# EAGLE design avr_adapter (EAGLE 9.6.2)
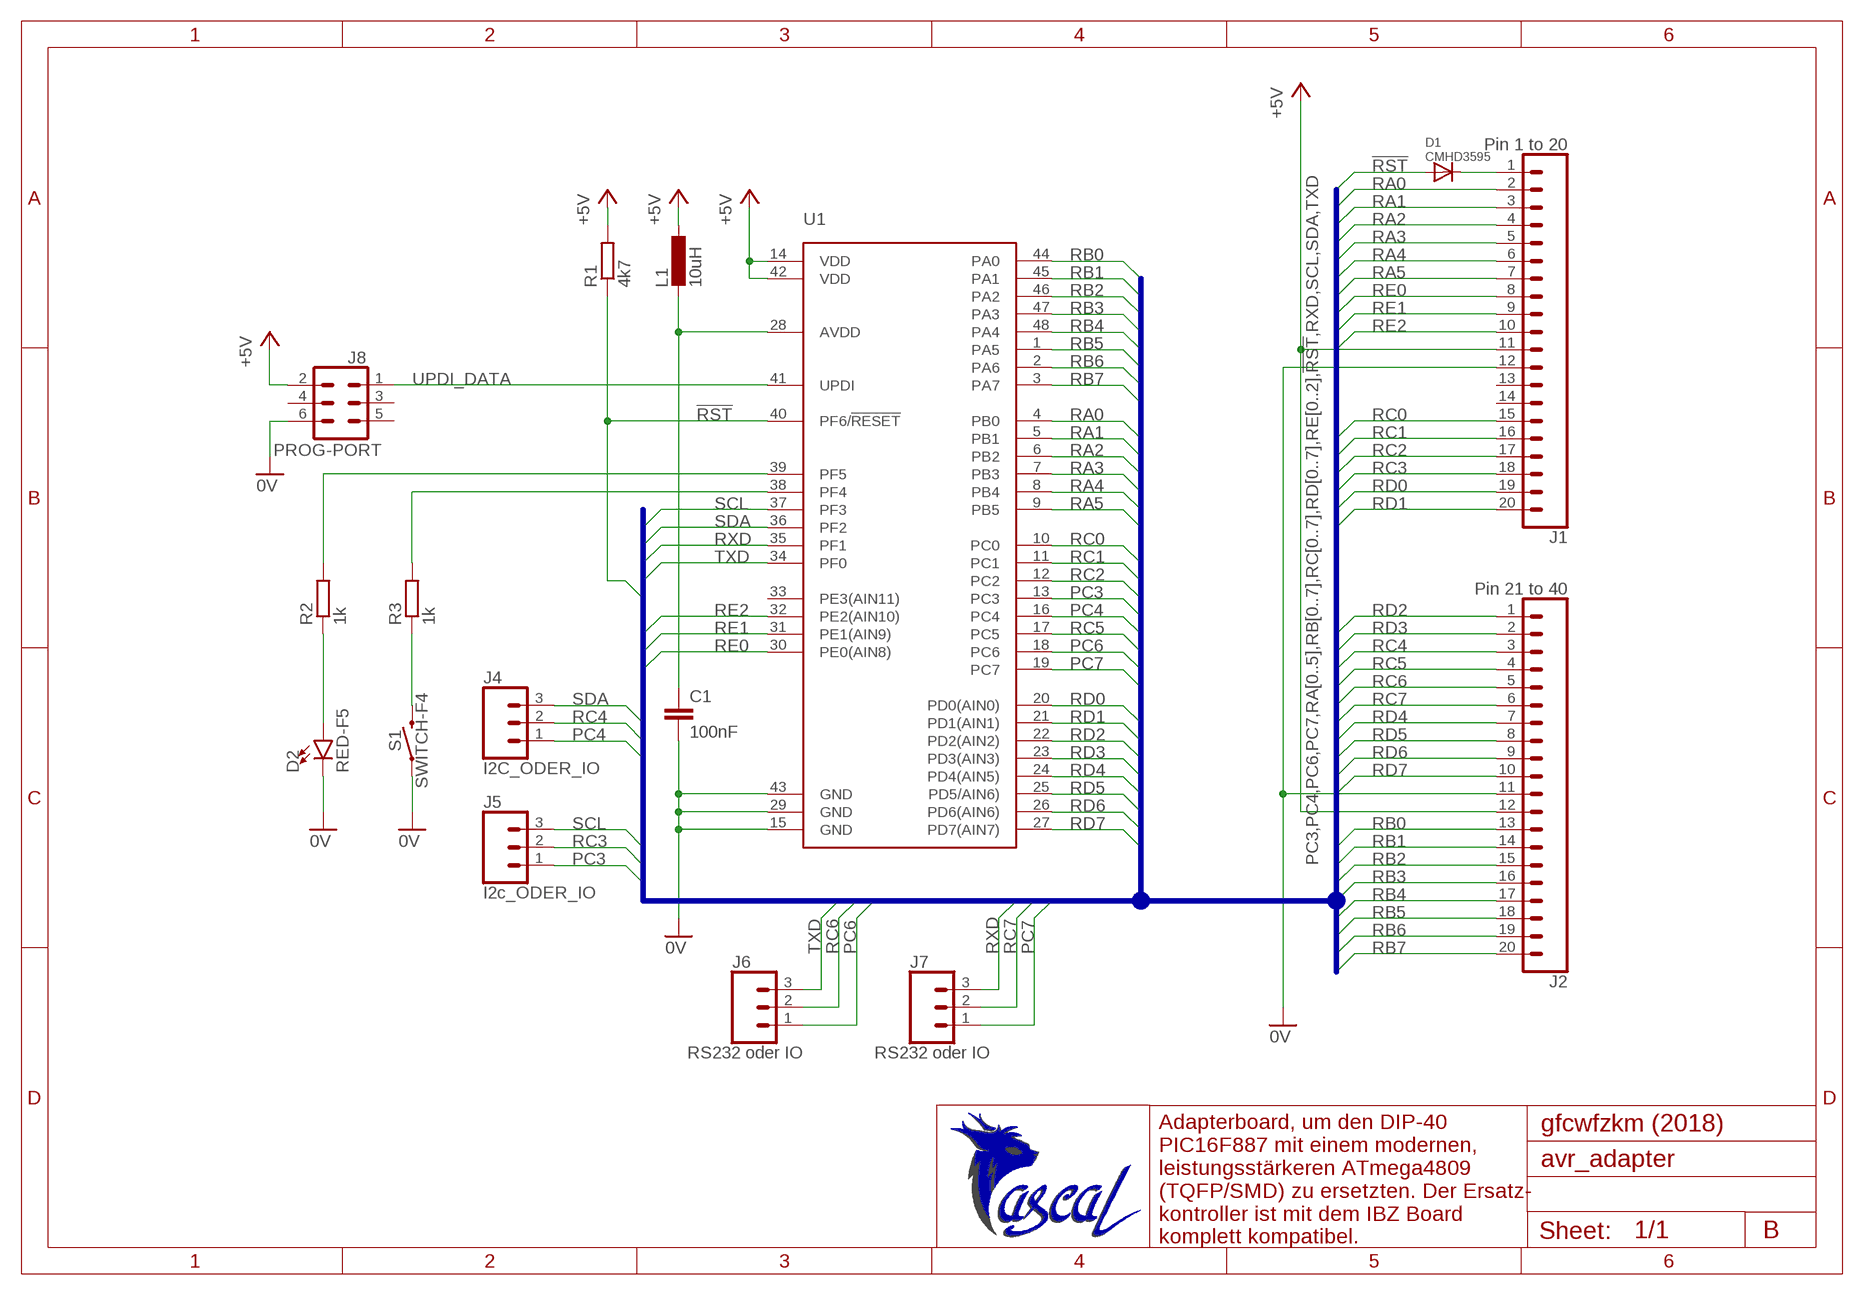
[diagram p0: schematic, sheet 1]

## Parts
C1  100nF  C-EUC0805  [C0805]
D1  CMHD3595  DIODESOD-123  [SOD-123]
D2  RED-F5  LED-FKIT-1206  [FKIT-LED-1206]
J1  Pin 1 to 20  CONN_20  [1X20]
J2  Pin 21 to 40  CONN_20  [1X20]
J4  I2C_ODER_IO  CONN_03  [1X03]
J5  I2c_ODER_IO  CONN_03  [1X03]
J6  RS232 oder IO  CONN_03  [1X03]
J7  RS232 oder IO  CONN_03  [1X03]
J8  PROG-PORT  CONN_03X2FEMALE  [2X3]
L1  10uH  L-EUL2012C  [L2012C]
R1  4k7  R-EU_R0805  [R0805]
R2  1k  R-EU_R0805  [R0805]
R3  1k  R-EU_R0805  [R0805]
S1  SWITCH-F4  MOMENTARY-SWITCH-SPST-SMD-6.0X3.5MM  [TACTILE_SWITCH_SMD_6.0X3.5MM]
U1  ATMEGA4809ATMEGA4809_TQFP48  [TQFP-48]
U$1  LOGO_PASCAL_GESELLEMPTY  [EMPTY]

## Nets
0V: C1.2 D2.C J1.12 J2.11 J8.6 S1.1 U1.15(GND) U1.29(GND) U1.43(GND)
!RST: D1.A R1.1 U1.40(PF6/!RESET)
+5V: J1.11 J2.12 J8.2 L1.1 R1.2 U1.14(VDD) U1.42(VDD)
N$1: D1.C J1.1
N$2: R2.2 U1.39(PF5)
N$3: C1.1 L1.2 U1.28(AVDD)
N$4: R3.2 U1.38(PF4)
N$5: D2.A R2.1
N$6: R3.1 S1.2
PC3: J5.1 U1.13(PC3)
PC4: J4.1 U1.16(PC4)
PC6: J6.1 U1.18(PC6)
PC7: J7.1 U1.19(PC7)
RA0: J1.2 U1.4(PB0)
RA1: J1.3 U1.5(PB1)
RA2: J1.4 U1.6(PB2)
RA3: J1.5 U1.7(PB3)
RA4: J1.6 U1.8(PB4)
RA5: J1.7 U1.9(PB5)
RB0: J2.13 U1.44(PA0)
RB1: J2.14 U1.45(PA1)
RB2: J2.15 U1.46(PA2)
RB3: J2.16 U1.47(PA3)
RB4: J2.17 U1.48(PA4)
RB5: J2.18 U1.1(PA5)
RB6: J2.19 U1.2(PA6)
RB7: J2.20 U1.3(PA7)
RC0: J1.15 U1.10(PC0)
RC1: J1.16 U1.11(PC1)
RC2: J1.17 U1.12(PC2)
RC3: J1.18 J5.2
RC4: J2.3 J4.2
RC5: J2.4 U1.17(PC5)
RC6: J2.5 J6.2
RC7: J2.6 J7.2
RD0: J1.19 U1.20(PD0(AIN0))
RD1: J1.20 U1.21(PD1(AIN1))
RD2: J2.1 U1.22(PD2(AIN2))
RD3: J2.2 U1.23(PD3(AIN3))
RD4: J2.7 U1.24(PD4(AIN5))
RD5: J2.8 U1.25(PD5/AIN6))
RD6: J2.9 U1.26(PD6(AIN6))
RD7: J2.10 U1.27(PD7(AIN7))
RE0: J1.8 U1.30(PE0(AIN8))
RE1: J1.9 U1.31(PE1(AIN9))
RE2: J1.10 U1.32(PE2(AIN10))
RXD: J7.3 U1.35(PF1)
SCL: J5.3 U1.37(PF3)
SDA: J4.3 U1.36(PF2)
TXD: J6.3 U1.34(PF0)
UPDI_DATA: J8.1 U1.41(UPDI)
Unconnected: J1.13 J1.14 J8.3 J8.4 J8.5 U1.33(PE3(AIN11))

## Buses
PC3,PC4,PC6,PC7,RA[0..5],RB[0..7],RC[0..7],RD[0..7],RE[0..2],!RST,RXD,SCL,SDA,TXD

## Notes on the sheet
- Adapterboard, um den DIP-40
  PIC16F887 mit einem modernen,
  leistungsstärkeren ATmega4809
  (TQFP/SMD) zu ersetzten. Der Ersatz-
  kontroller ist mit dem IBZ Board
  komplett kompatibel.
- gfcwfzkm (2018)
- B

## Library data of the parts
C1 = rcl:C-EU: CAPACITOR, European symbol; SPICEPREFIX: C
D1 = adafruit:DIODE: Diode SMADIODE - SMA Surface Mount Package 20V 1A Schottky Diode Digikey: 641-1014-6-ND DO-1N4148 - Through Hole Small Current Diode SOD-123 20V 1 A (.5mV Vf) Schottky Diode - Digikey: MBRX120TPMSCT-ND SOD-323 10V 570mA (.38mV Vf, 3ns) Schottky Diode - Digikey: ZLLS410CT-ND SOD-523 30V 30mA Schottky Diode (RB751S-40TE61) - Digikey: RB751S-40TE61CT-ND SOT23-R/W - SOT23 Package (R = Solder Paste/Reflow Ovens, W = Hand-Soldering) BAT54Film 40V 300mA - Digikey: 497-7162-1-ND
D2 = SparkFun-LED:LED: LED (Generic) Standard schematic elements and footprints for 5mm, 3mm, 1206, and 0603 sized LEDs. Generic LEDs with no color specified.
J1 J2 = SparkFun-Connectors:CONN_20: Multi connection point. Often used as Generic Header-pin footprint for 0.1 inch spaced/style header connections On any of the 0.1 inch spaced packages, you can populate with these: Break Away Headers - Straight <https://www.sparkfun.com/products/116> (PRT-00116) Break Away Male Headers - Right Angle <https://www.sparkfun.com/products/553> (PRT-00553) Female Headers <https://www.sparkfun.com/products/115> (PRT-00115) Break Away Headers - Machine Pin <https://www.sparkfun.com/products/117> (PRT-00117) Break Away Female Headers - Swiss Machine Pin <https://www.sparkfun.com/products/743> (PRT-00743) For SCREWTERMINALS and SPRING TERMINALS visit here: Screw Terimnals on SparkFun.com <https://www.sparkfun.com/search/results?term=Screw+Terminals> (5mm/3.5mm/2.54mm spacing) This device is also useful as a general connection point to wire up your design to another part of your project. Our various solder wires solder well into these plated through hole pads. Hook-Up Wire - Assortment (Stranded, 22 AWG) <https://www.sparkfun.com/products/11375> (PRT-11375) Hook-Up Wire - Assortment (Solid Core, 22 AWG) <https://www.sparkfun.com/products/11367> (PRT-11367) View the entire wire category on our website here <https://www.sparkfun.com/categories/141> Special notes: Molex polarized connector foot print use with SKU : PRT-08231 with associated crimp pins and housings. 1MM SMD Version SKU: PRT-10208 NOTES ON THE VARIANTS LOCK and LOCK_LONGPADS... This footprint was designed to help hold the alignment of a through-hole component (i.e. 6-pin header) while soldering it into place. You may notice that each hole has been shifted either up or down by 0.005 of an inch from it's more standard position (which is a perfectly straight line). This slight alteration caused the pins (the squares in the middle) to touch the edges of the holes. Because they are alternating, it causes a "brace" to hold the component in place. 0.005 has proven to be the perfect amount of "off-center" position when using our standard breakaway headers. Although looks a little odd when you look at the bare footprint, once you have a header in there, the alteration is very hard to notice. Also,if you push a header all the way into place, it is covered up entirely on the bottom side. Note about LOCK SPECIAL package: This is just like the LOCK variant in that the holes are staggared by 5 mil, but except for the last two holes. They are not altered from the "standard" footprint layout. This is used for a special purpose on the layout of our Graphic LCD Backpack. Make sure you want to use this device before selecting it for you project!
J4-J7 = SparkFun-Connectors:CONN_03: Multi connection point. Often used as Generic Header-pin footprint for 0.1 inch spaced/style header connections On any of the 0.1 inch spaced packages, you can populate with these: Break Away Headers - Straight <https://www.sparkfun.com/products/116> (PRT-00116) Break Away Male Headers - Right Angle <https://www.sparkfun.com/products/553> (PRT-00553) Female Headers <https://www.sparkfun.com/products/115> (PRT-00115) Break Away Headers - Machine Pin <https://www.sparkfun.com/products/117> (PRT-00117) Break Away Female Headers - Swiss Machine Pin <https://www.sparkfun.com/products/743> (PRT-00743) Stackable Header - 3 Pin (Female, 0.1") <https://www.sparkfun.com/products/13875> (PRT-13875) For SCREWTERMINALS and SPRING TERMINALS visit here: Screw Terimnals on SparkFun.com <https://www.sparkfun.com/search/results?term=Screw+Terminals> (5mm/3.5mm/2.54mm spacing) This device is also useful as a general connection point to wire up your design to another part of your project. Our various solder wires solder well into these plated through hole pads. Hook-Up Wire - Assortment (Stranded, 22 AWG) <https://www.sparkfun.com/products/11375> (PRT-11375) Hook-Up Wire - Assortment (Solid Core, 22 AWG) <https://www.sparkfun.com/products/11367> (PRT-11367) View the entire wire category on our website here <https://www.sparkfun.com/categories/141> Special notes: Molex polarized connector foot print use with SKU : PRT-08232 with associated crimp pins and housings.
J8 = SparkFun-Connectors:CONN_03X2: Multi connection point. Often used as Generic Header-pin footprint for 0.1 inch spaced/style header connections You can populate with any combo of single row headers, but if you'd like an exact match, check these: Header - 2x3 (Male, 0.1") <https://www.sparkfun.com/products/12807> (PRT-12807) Header - 2x3 (Female, 0.1") <https://www.sparkfun.com/products/13010> (PRT-13010) 2x3 Pin Shrouded Header <https://www.sparkfun.com/products/10877> (PRT-10877) On any of the 0.1 inch spaced packages, you can populate with these: Break Away Headers - Straight <https://www.sparkfun.com/products/116> (PRT-00116) Break Away Male Headers - Right Angle <https://www.sparkfun.com/products/553> (PRT-00553) Female Headers <https://www.sparkfun.com/products/115> (PRT-00115) Break Away Headers - Machine Pin <https://www.sparkfun.com/products/117> (PRT-00117) Break Away Female Headers - Swiss Machine Pin <https://www.sparkfun.com/products/743> (PRT-00743) Special note: the shrouded connector mates well with our 3x2 ribbon cables: Ribbon Crimp Connector - 6-pin (2x3, Female) <https://www.sparkfun.com/products/10651> (PRT-10651) Ribbon Cable - 6 wire (15ft) <https://www.sparkfun.com/products/10646> (PRT-10646); PROD_ID: CONN-11566; VALUE: FEMALE 2x3
L1 = rcl:L-EU: INDUCTOR, European symbol; SPICEPREFIX: L
R1-R3 = rcl:R-EU_: RESISTOR, European symbol; SPICEPREFIX: R
S1 = SparkFun-Switches:MOMENTARY-SWITCH-SPST: Momentary Switch (Pushbutton) - SPST Normally-open (NO) SPST momentary switches (buttons, pushbuttons). Variants PTH-12MM - 12mm square, through-hole Momentary Pushbutton Switch - 12mm Square <https://www.sparkfun.com/products/9190> (COM-09190) PTH-6.0MM, PTH-6.0MM-KIT - 6.0mm square, through-hole Mini Pushbutton Switch <https://www.sparkfun.com/products/97> (COM-00097) KIT package intended for soldering kit's - only one side of pads' copper is exposed. PTH-RIGHT-ANGLE-KIT - Right-angle, through-hole Right Angle Tactile Button <https://www.sparkfun.com/products/10791> - Used on SparkFun BigTime Watch Kit <https://www.sparkfun.com/products/11734> SMD-12MM - 12mm square, surface-mount Tactile Button - SMD (12mm) <https://www.sparkfun.com/products/12993> (COM-12993) Used on SparkFun PicoBoard <https://www.sparkfun.com/products/11888> SMD-4.5MM - 4.5mm Square Trackball Switch Used on SparkFun Blackberry Trackballer Breakout <https://www.sparkfun.com/products/13169> SMD-4.6MMX2.8MM - 4.60mm x 2.80mm, surface mount Used on SparkFun SAMD21 Mini Breakout <https://www.sparkfun.com/products/13664> SMD-5.2MM, SMD-5.2-REDUNDANT - 5.2mm square, surface-mount Mini Pushbutton Switch - SMD <https://www.sparkfun.com/products/8720> (COM-08720) Used on Arduino Pro Mini <https://www.sparkfun.com/products/11114> REDUNDANT package connects both switch circuits together SMD-6.0X3.5MM - 6.0 x 3.5mm, surface mount Momentary Reset Switch SMD <https://www.sparkfun.com/products/8229> (COM-08229) SMD-6.2MM-TALL - 6.2mm square, surface mount Tactile Button - SMD (6mm) <https://www.sparkfun.com/products/12992> Used on SparkFun Digital Sandbox <https://www.sparkfun.com/products/12651> SMD-RIGHT-ANGLE - Right-angle, surface mount Used on SparkFun Block for Intel® Edison - Arduino <https://www.sparkfun.com/products/13036>; PROD_ID: SWCH-00815; SF_SKU: COM-08229
U1 = Pascal_Library:ATMEGA4809
U$1 = Pascal_Library:LOGO_PASCAL_GESELL: Mein Logo halt

## Board
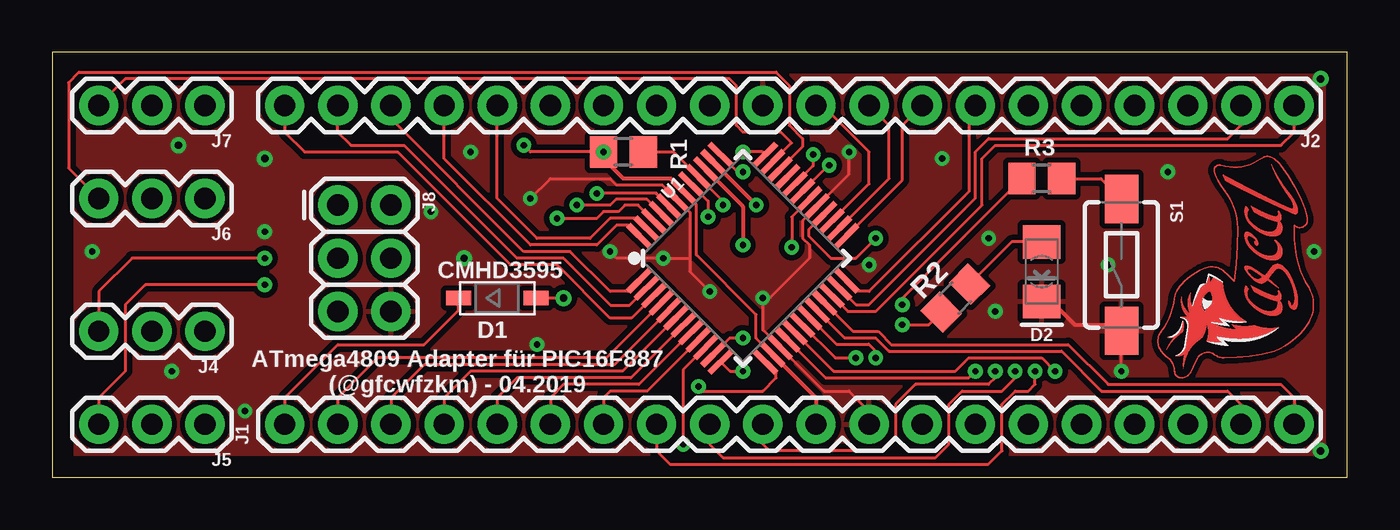
[diagram p1: board, top side]
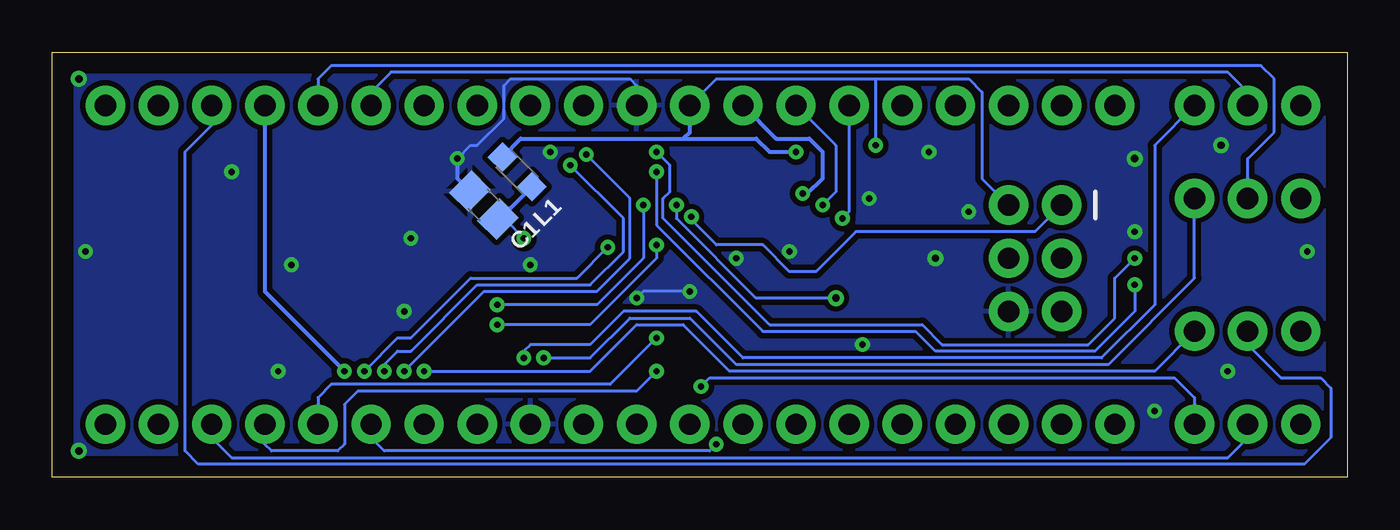
[diagram p2: board, bottom side, seen from below]

Size 61.91 x 20.32 mm. Coordinates in mm from the lower left corner, seen from the top.
Outline: 61.91,0 61.91,20.32 0,20.32 0,0 61.91,0
Copper layers (1*16): Top 0.035mm / dielectric 1.5mm / Bottom 0.035mm
Design rules "default *": minimum track width 5mil, minimum drill 0.3mm, track to track 5mil, track to pad 5mil, pad to pad 5mil, via to via 5mil, smd to smd 5mil, copper to edge 40mil, drill to drill 6mil, minimum pad ring 10mil, minimum via ring 8mil, stop-mask expansion 4mil, vias tented up to drill 0mil, thermal gap 10mil

### Footprints (pad centres in the part's own frame; a part is rotated, then mirrored left to right if it is on the bottom)
C0805 = smd 1.3 x 1.5: 1 -0.95,0; 2 0.95,0
SOD-123 = smd 1.2 x 0.7: A 1.85,0; C -1.85,0
FKIT-LED-1206 = smd 1.6 x 1.803: A -1.422,0; C 1.422,0
1X20 = drill 1.016 pad 1.88: 1 0,0; 2 2.54,0; 3 5.08,0; 4 7.62,0; 5 10.16,0; 6 12.7,0; 7 15.24,0; 8 17.78,0; 9 20.32,0; 10 22.86,0; 11 25.4,0; 12 27.94,0; 13 30.48,0; 14 33.02,0; 15 35.56,0; 16 38.1,0; 17 40.64,0; 18 43.18,0; 19 45.72,0; 20 48.26,0
1X03 = drill 1.016 pad 1.88: 1 0,0; 2 2.54,0; 3 5.08,0
2X3 = drill 1.016 pad 1.88: 1 0,0; 2 0,2.54; 3 2.54,0; 4 2.54,2.54; 5 5.08,0; 6 5.08,2.54
L2012C = smd 1 x 1: 1 -1,0; 2 1,0
R0805 = smd 1.3 x 1.5: 1 -0.95,0; 2 0.95,0
TACTILE_SWITCH_SMD_6.0X3.5MM = smd 2.3 x 1.6: 1 -3.15,0; 2 3.15,0
TQFP-48 = smd 1.5 x 0.28: 1 -4.25,2.75; 2 -4.25,2.25; 3 -4.25,1.75; 4 -4.25,1.25; 5 -4.25,0.75; 6 -4.25,0.25; 7 -4.25,-0.25; 8 -4.25,-0.75; 9 -4.25,-1.25; 10 -4.25,-1.75; 11 -4.25,-2.25; 12 -4.25,-2.75; 25 4.25,-2.75; 26 4.25,-2.25; 27 4.25,-1.75; 28 4.25,-1.25; 29 4.25,-0.75; 30 4.25,-0.25; 31 4.25,0.25; 32 4.25,0.75; 33 4.25,1.25; 34 4.25,1.75; 35 4.25,2.25; 36 4.25,2.75 | smd 0.28 x 1.5: 13 -2.75,-4.25; 14 -2.25,-4.25; 15 -1.75,-4.25; 16 -1.25,-4.25; 17 -0.75,-4.25; 18 -0.25,-4.25; 19 0.25,-4.25; 20 0.75,-4.25; 21 1.25,-4.25; 22 1.75,-4.25; 23 2.25,-4.25; 24 2.75,-4.25; 37 2.75,4.25; 38 2.25,4.25; 39 1.75,4.25; 40 1.25,4.25; 41 0.75,4.25; 42 0.25,4.25; 43 -0.25,4.25; 44 -0.75,4.25; 45 -1.25,4.25; 46 -1.75,4.25; 47 -2.25,4.25; 48 -2.75,4.25

### Placement (x,y rotation side)
C1  41.27,13.02 135 bottom
D1  21.27,8.57 0 top
D2  47.31,9.84 270 top
J1  11.11,2.54 0 top
J2  59.37,17.78 180 top
J4  7.3,6.99 180 top
J5  7.3,2.54 180 top
J6  7.3,13.34 180 top
J7  7.3,17.78 180 top
J8  13.65,13.02 270 top
L1  39.69,14.61 315 bottom
R1  27.3,15.56 180 top
R2  43.18,8.57 225 top
R3  47.31,14.29 180 top
S1  51.12,10.16 90 top
U1  33.02,10.48 45 top
U$1  -3.81,-5.4 0 top  (outside the outline)

### Tracks (layer width: path | path; a pad name or v marks a point on that pad's centre or on a via)
0V  (via drill 0.3, 0.35)
  Top 0.152: v51.12,5.08 51.12,6.64 50.46,7.3 | v38.1,15.56 38.1,14.5 U1.29 35.88,12.27 35.88,11.43 36.2,11.11 36.2,10.48 34.29,8.57 v33.97,8.57 33.97,7.05 U1.15 36.9,4.13 38.1,4.13 39.05,3.17 J1.12 | v22.86,13.34 23.81,14.29 26.67,14.29 26.99,13.97 29.17,13.97 U1.43 30.48,12.66 30.48,10.48 | v31.43,8.89 30.48,9.84 30.48,10.48 | 30.48,10.48 v29.21,10.48 26.99,10.48 v26.67,10.79
  Top 0.2: D2.C 47.78,8.42 48.9,7.3 50.46,7.3 51.41,7.3 S1.1
  Bottom 0.152: v42.55,15.24 41.91,15.88 41.59,15.88 40.32,17.14 40.32,18.73 40.01,19.05 34.29,19.05 33.97,18.73 J2.11 | v31.43,8.89 33.66,8.89 v33.97,8.57
  Bottom 0.2: C1.2 42.55,14.29 v42.55,15.24
  other vias: 19.68,10.48 1.91,10.79 5.71,5.08 20,15.56 50.48,10.16 9.21,3.17 23.18,6.35 10.16,11.75 6.03,15.88 10.16,15.24 60.64,1.27 60.64,19.05 18.1,12.7 39.05,10.16 44.77,11.43 45.09,7.94 53.34,14.61 60.33,10.79
  pour Bottom (isolate 0.254): 0,0 0,20.32 61.91,20.32 61.91,0
  pour Top (isolate 0.254): 0,0 61.91,0 61.91,20.32 0,20.32
!RST  (via drill 0.3, 0.35)
  Top 0.152: v24.45,8.57 D1.A | v32.07,13.02 32.07,13.2 U1.40 29.71,15.56 R1.1
  Bottom 0.152: v32.07,13.02 32.07,12.38 28.26,8.57 v24.45,8.57
+5V  (via drill 0.3)
  Top 0.152: v22.54,15.88 22.86,15.56 v26.35,15.56 R1.2 | U1.42 30.8,13.05 30.8,10.64 33.66,7.79 33.66,6.66 U1.14
  Top 0.2: U1.14 36.51,3.8 J1.11 | U1.42 29.56,14.29 27.3,14.29 26.36,15.24 R1.2
  Bottom 0.152: J8.2 17.46,14.29 17.46,18.41 18.1,19.05 22.54,19.05 | J2.12 30.16,19.05 22.54,19.05 | v22.54,15.88 22.54,19.05
  Bottom 0.2: 31.75,16.19 39.51,16.19 L1.1 | J2.12 31.43,16.51 31.75,16.19 | 31.75,16.19 28.26,16.19 27.62,15.56 v26.35,15.56
N$1
  Top 0.152: J1.1 11.11,3.81 13.65,6.35 17.78,6.35 19.42,7.99 D1.C
N$2  (via drill 0.3)
  Top 0.152: v40.64,7.3 41.91,7.3 R2.2
  Top 0.2: v33.02,11.11 33.02,12.95 U1.39
  Bottom 0.152: v33.02,11.11 33.02,10.48 36.2,7.3 v40.64,7.3
N$3  (via drill 0.3)
  Top 0.152: U1.28 36.16,11.85 36.16,11.55 37.23,10.48 38.42,10.48 v39.37,11.43
  Bottom 0.152: v39.37,11.43 40.18,12.24 40.64,12.24 | 40.64,12.24
  Bottom 0.2: L1.2 40,12.88 40.53,12.35 | 40.53,12.35 40.64,12.24 40.67,12.28 C1.1 40.53,12.35
N$4  (via drill 0.3)
  Top 0.152: R3.2 46.04,13.97 40.64,8.57 v40.64,8.26
  Top 0.2: v33.66,13.02 U1.38
  Bottom 0.152: v33.66,13.02 33.66,10.48 35.88,8.26 v40.64,8.26
N$5
  Top 0.152: D2.A 45.87,11.26 R2.1
N$6
  Top 0.152: S1.2 50.14,14.29 R3.1
N$8
  Top 0.076: 55.88,13.97 arc-18 55.56,14.61 arc-125 55.88,14.92 arc54 57.78,15.24 arc-73 58.42,15.24 arc-17 58.74,14.92 arc-11 59.69,13.34 arc-14 60.01,12.38 arc-150 59.37,12.06 59.37,11.75 arc19 59.69,9.84 arc15 60.01,9.21 arc-68 60.01,7.3 arc-34 58.42,6.03 arc-15 56.04,5.71 arc-37 55.56,5.87 arc96 54.77,5.71 arc8 54.45,5.08 arc-67 53.98,4.76 arc-90 53.66,5.08 arc53 53.34,5.71 arc-16 53.02,6.03 arc-74 53.02,6.99 arc30 53.66,8.57 arc-40 53.98,9.21 54.13,9.37 arc-23 55.09,10 arc-64 56.04,9.84 arc-7 56.52,9.37 arc7 56.67,11.91 arc34 56.2,13.49 55.88,13.97
PC3  (via drill 0.3)
  Top 0.152: v30.89,4.35 31.11,4.13 33.97,4.13 34.61,4.76 34.61,5 U1.13
  Bottom 0.152: J5.1 7.3,3.81 8.26,4.76 30.48,4.76 v30.89,4.35
PC4  (via drill 0.3)
  Top 0.152: U1.16 36.97,4.76 43.81,4.76 v44.13,5.08
  Bottom 0.152: J4.1 9.21,5.08 29.53,5.08 31.75,7.3 33.97,7.3 36.2,5.08 v44.13,5.08
PC6  (via drill 0.3)
  Top 0.152: U1.18 37.43,5.71 v38.41,5.71
  Top 0.2: v38.41,5.71 v38.42,5.71
  Bottom 0.152: J6.1 7.3,9.53 11.43,5.4 29.21,5.4 31.43,7.62 34.29,7.62 36.2,5.71 v38.42,5.71
PC7  (via drill 0.3)
  Top 0.152: U1.19 37.48,6.37 39.03,6.37 39.37,6.03 v39.37,5.71
  Bottom 0.152: J7.1 9.21,15.88 9.21,8.26 11.75,5.71 28.89,5.71 31.11,7.94 34.61,7.94 36.2,6.35 39.05,6.35 39.37,6.03 v39.37,5.71
RA0
  Top 0.152: J1.2 13.65,3.81 15.56,5.71 26.49,5.71 U1.4
RA1
  Top 0.152: U1.5 26.88,5.4 17.78,5.4 16.19,3.81 J1.3
RA2
  Top 0.152: U1.6 27.27,5.08 20,5.08 18.73,3.81 J1.4
RA3
  Top 0.152: J1.5 21.27,3.81 22.23,4.76 27.66,4.76 U1.7
RA4
  Top 0.152: U1.8 28.05,4.45 24.45,4.45 23.81,3.81 J1.6
RA5
  Top 0.152: U1.9 28.44,4.13 26.67,4.13 26.35,3.81 J1.7
RB0  (via drill 0.3)
  Top 0.152: U1.44 28.88,13.56 28.89,13.57 v26.04,13.57
  Bottom 0.2: J2.13 27.3,16.19 25.72,16.19 25.08,15.56 25.08,14.29 25.8,13.57 v26.04,13.57
RB1  (via drill 0.3)
  Top 0.152: v25.08,13.02 26.67,13.02 26.95,13.29 28.43,13.29 U1.45
  Bottom 0.152: v25.08,13.02 24.45,13.65 24.45,15.88 J2.14
RB2  (via drill 0.3)
  Top 0.152: v24.13,12.38 26.04,12.38 26.35,12.7 27.07,12.7 27.38,13.02 28.01,13.02 U1.46 28.32,12.7
  Bottom 0.152: J2.15 23.81,12.7 v24.13,12.38
RB3
  Top 0.152: J2.16 21.27,13.34 23.18,11.43 25.72,11.43 26.67,12.38 27.93,12.38 U1.47
RB4
  Top 0.152: J2.17 18.73,15.24 22.86,11.11 26.04,11.11 26.99,12.06 27.54,12.06 U1.48
RB5
  Top 0.152: 16.19,17.14 22.54,10.79 24.77,10.79 26.67,8.89 27.54,8.89 U1.1
  Top 0.2: 16.19,17.14 J2.18
RB6
  Top 0.152: J2.19 13.65,16.51 14.29,15.88 16.83,15.88 22.21,10.49 24.44,10.49 26.71,8.22 27.58,8.22 U1.2
RB7
  Top 0.152: J2.20 11.11,16.51 12.06,15.56 16.51,15.56 21.91,10.16 24.13,10.16 26.67,7.62 27.69,7.62 U1.3 | U1.3
RC0  (via drill 0.3)
  Top 0.152: U1.10 30.16,5.14 v30.16,1.59
  Bottom 0.152: v30.16,1.59 30.48,1.27 46.04,1.27 46.67,1.91 J1.15
RC1  (via drill 0.3)
  Top 0.152: U1.11 32.39,6.67 v33.02,6.67
  Bottom 0.152: v33.02,6.67 35.24,4.45 48.58,4.45 49.21,3.81 J1.16
RC2  (via drill 0.3)
  Top 0.152: U1.12 32.41,5.08 v33.02,5.08
  Bottom 0.152: v33.02,5.08 33.97,4.13 47.31,4.13 47.94,3.49 47.94,1.59 48.26,1.27 51.44,1.27 51.75,1.59 J1.17
RC3
  Bottom 0.152: J1.18 54.29,1.91 53.34,0.95 5.71,0.95 4.76,1.91 J5.2
RC4
  Bottom 0.152: J4.2 4.76,6.35 3.17,4.76 1.27,4.76 0.78,4.27 0.78,1.91 2.04,0.64 54.93,0.64 55.56,1.27 55.56,15.56 54.29,16.83 J2.3
RC5  (via drill 0.3)
  Top 0.152: U1.17 37.35,5.08 43.18,5.08 43.81,5.71 47.31,5.71 v47.94,5.08
  Bottom 0.2: J2.4 51.75,8.89 v47.94,5.08
RC6
  Bottom 0.152: J6.2 4.76,15.24 3.49,16.51 3.49,19.05 4.13,19.68 48.58,19.68 49.21,19.05 J2.5
RC7
  Bottom 0.152: J7.2 4.76,18.41 5.71,19.37 45.72,19.37 46.67,18.41 J2.6
RD0
  Top 0.152: J1.19 56.83,3.49 56.2,4.13 50.16,4.13 48.26,6.03 40.01,6.03 39.37,6.67 37.88,6.67 U1.20
RD1
  Top 0.152: J1.20 59.37,3.81 58.74,4.45 50.48,4.45 48.58,6.35 40.12,6.35 39.49,6.98 38.29,6.98 U1.21
RD2
  Top 0.152: J2.1 59.37,16.51 58.74,15.88 45.09,15.88 44.45,15.24 44.45,13.02 39.37,7.94 38.03,7.94 U1.22
RD3
  Top 0.152: J2.2 56.83,16.83 56.2,16.19 44.77,16.19 44.13,15.56 44.13,13.34 39.05,8.26 38.42,8.26 U1.23
RD4
  Top 0.152: J2.7 44.13,17.46 43.81,17.14 43.81,13.65 39.05,8.89 38.42,8.89 37.97,9.34 U1.24
RD5
  Top 0.152: U1.25 40.64,14.21 40.64,16.83 J2.8
RD6
  Top 0.152: U1.26 40.01,14.28 40.01,16.83 J2.9
RD7
  Top 0.152: U1.27 39.05,14.04 39.05,15.56 36.83,17.78 J2.10
RE0  (via drill 0.3)
  Top 0.152: 36.46,13.57 U1.30 35.36,12.46 v35.36,11 | J1.8 28.89,1.27 29.53,0.64 44.77,0.64 45.4,1.27 45.4,3.49 46.04,4.13 46.67,4.13 46.99,4.45 v46.99,5.08
  Bottom 0.152: v46.99,5.08 45.4,6.67 44.77,6.67 41.91,9.53 36.83,9.53 v35.36,11
RE1  (via drill 0.3)
  Top 0.152: J1.9 31.43,1.59 32.07,0.95 42.23,0.95 42.86,1.59 42.86,3.49 43.5,4.13 45.4,4.13 46.04,4.76 v46.04,5.08 | v37.15,14.92 37.11,14.92 U1.31
  Bottom 0.152: v46.04,5.08 46.04,5.4 45.4,6.03 44.77,6.03 41.59,9.21 36.2,9.21 34.61,10.79 34.61,12.38 v37.15,14.92
RE2  (via drill 0.3)
  Top 0.152: v36.38,15.44 36.38,14.89 U1.32 | J1.10 33.97,1.59 34.29,1.27 39.69,1.27 40.32,1.91 40.32,3.49 41.27,4.45 44.77,4.45 45.09,4.76 v45.09,5.08
  Bottom 0.152: v45.09,5.08 41.27,8.89 35.88,8.89 34.29,10.48 34.29,13.34 36.38,15.42 v36.38,15.44
RXD
  Top 0.152: U1.35 35.35,15.99 34.83,16.51 33.02,16.51 32.7,16.83 32.7,18.73 32.38,19.05 3.49,19.05 J7.3
SCL  (via drill 0.3)
  Top 0.152: U1.37 32.69,14.69 v33.02,14.61 | v10.16,9.21 4.45,9.21 3.49,8.26 3.49,5.08 2.22,3.81 J5.3
  Bottom 0.152: v33.02,14.61 33.02,12.06 27.94,6.99 20.64,6.99 19.68,6.03 12.06,6.03 10.16,7.94 v10.16,9.21
SDA  (via drill 0.3)
  Top 0.152: U1.36 33.95,15.56 v33.02,15.56 | v10.16,10.48 3.81,10.48 2.22,8.89 J4.3
  Bottom 0.152: v33.02,15.56 32.38,14.92 32.38,13.65 32.7,13.34 32.7,12.38 27.62,7.3 20.32,7.3 19.37,6.35 12.38,6.35 11.11,7.62 11.11,9.53 v10.16,10.48
TXD
  Top 0.152: U1.34 35.88,15.81 35.88,16.19 35.24,16.83 35.24,18.73 34.61,19.37 1.27,19.37 0.78,18.87 0.78,14.78 J6.3
UPDI_DATA  (via drill 0.3)
  Top 0.152: v31.36,12.46 31.36,13.2 U1.41
  Bottom 0.152: J8.1 14.92,11.75 23.5,11.75 25.4,9.84 26.67,9.84 27.94,11.11 30.16,11.11 31.43,12.38 v31.36,12.46
(copper drawn outside any net)
  shapes: Top area x11057

### Text on the board
tPlace: ATmega4809 Adapter für PIC16F887 / (@gfcwfzkm) - 04.2019
tValues: PROG-PORT | ATmega4809-AFR
200bmp: C:/Users/pasca/Pictures/My Lynx (Kitty =3)/Pazs_icon_copper.bmp | C:/Users/pasca/Pictures/My Lynx (Kitty =3)/Pazs_icon_nosilks.bmp | C:/Users/pasca/Pictures/My Lynx (Kitty =3)/Pazs_icon_silks.bmp